# EAGLE design max_plate (EAGLE 7.5.0)
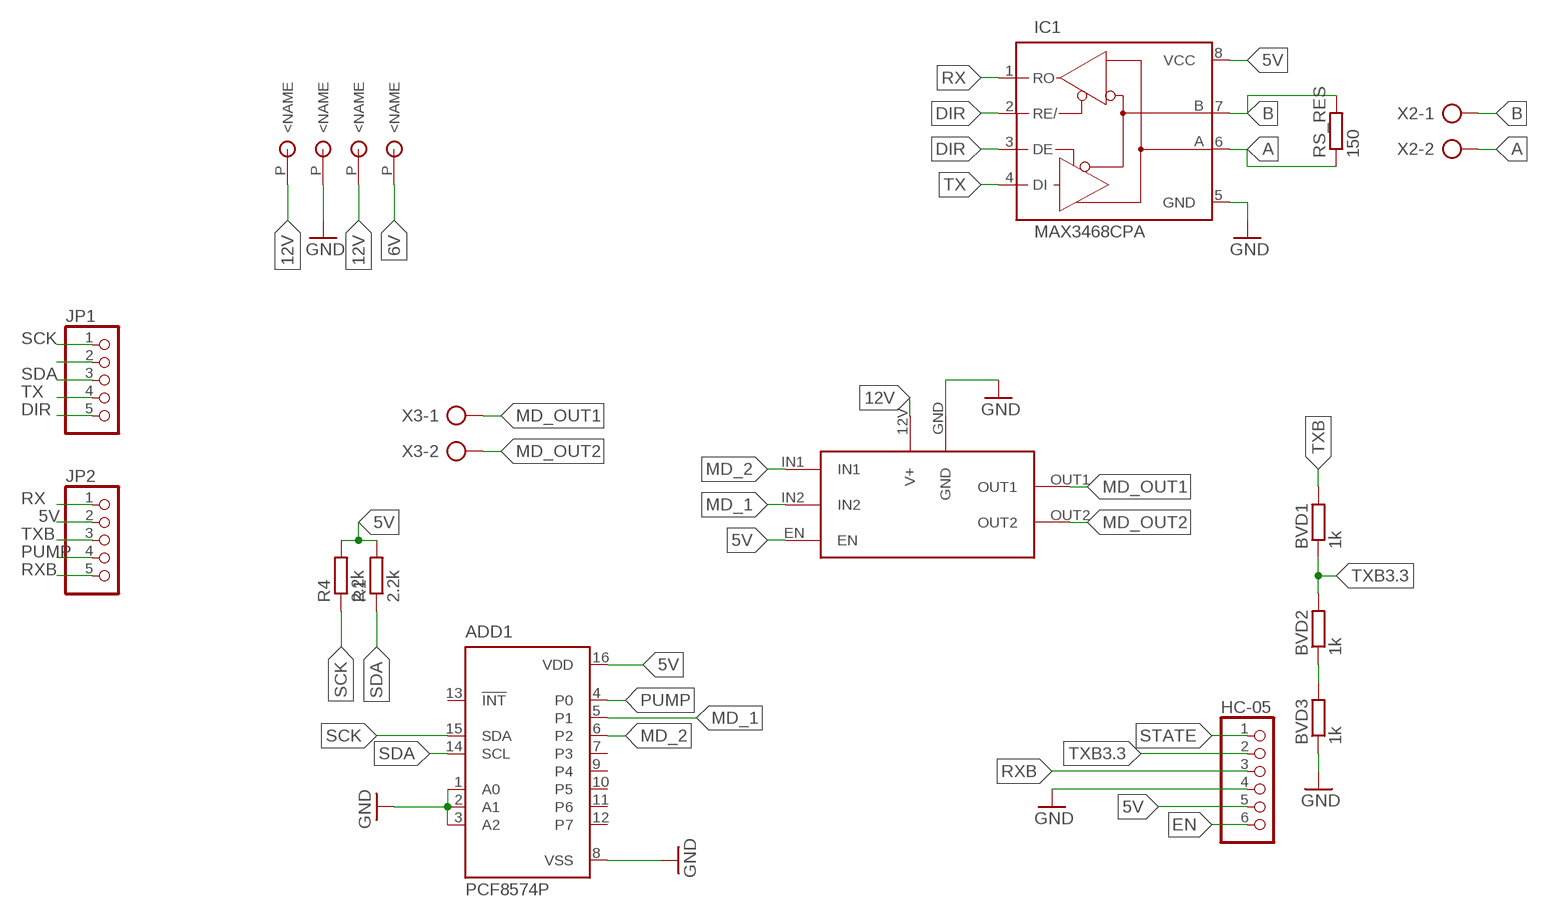
[diagram p0: schematic, sheet 1]

## Parts
ADD1  PCF8574P  [DIL16]
BVD1  1k  R-EU_0207/10  [0207/10]
BVD2  1k  R-EU_0207/10  [0207/10]
BVD3  1k  R-EU_0207/10  [0207/10]
HC-05  PINHD-1X6  [1X06]
IC1  MAX3468CPA  [DIL08]
JP1  PINHD-1X5  [1X05]
JP2  PINHD-1X5  [1X05]
R1  2.2k  R-EU_0207/10  [0207/10]
R4  2.2k  R-EU_0207/10  [0207/10]
RS_RES  150  R-EU_0207/10  [0207/10]
U$1  CU-SPACER  [CU-SPACER]
U$2  CU-SPACER  [CU-SPACER]
U$3  CU-SPACER  [CU-SPACER]
U$4  CU-SPACER  [CU-SPACER]
U$5  L6203-MODULE  [L6203-MODULE]
X2  AK500/2  [AK500/2]
X3  AK500/2  [AK500/2]

## Nets
5V: ADD1.16(VDD) HC-05.5 IC1.8(VCC) JP2.2 R1.2 R4.2 U$5.EN
6V: U$4.P(<NAME)
12V: U$1.P(<NAME) U$3.P(<NAME) U$5.12V(V+)
A: IC1.6(A) RS_RES.1 X2.2
B: IC1.7(B) RS_RES.2 X2.1
DIR: IC1.2(RE/) IC1.3(DE) JP1.5
EN: HC-05.6
GND: ADD1.1(A0) ADD1.2(A1) ADD1.3(A2) ADD1.8(VSS) BVD3.1 HC-05.4 IC1.5(GND) U$2.P(<NAME) U$5.GND
MD_1: ADD1.5(P1) U$5.IN2
MD_2: ADD1.6(P2) U$5.IN1
MD_OUT1: U$5.OUT1 X3.1
MD_OUT2: U$5.OUT2 X3.2
N$2: JP1.2
N$3: BVD2.1 BVD3.2
PUMP: ADD1.4(P0) JP2.4
RX: IC1.1(RO) JP2.1
RXB: HC-05.3 JP2.5
SCK: ADD1.15(SDA) JP1.1 R4.1
SDA: ADD1.14(SCL) JP1.3 R1.1
STATE: HC-05.1
TX: IC1.4(DI) JP1.4
TXB: BVD1.2 JP2.3
TXB3.3: BVD1.1 BVD2.2 HC-05.2
Unconnected: ADD1.7(P3) ADD1.9(P4) ADD1.10(P5) ADD1.11(P6) ADD1.12(P7) ADD1.13(!INT)

## Library data of the parts
ADD1 = micro-philips:PCF8574: I2C-Bus Remote 8-bit I/O expander http://www.semiconductors.philips.com/acrobat_download/datasheets/PCF8574_4.pdf; MPN: PCF8574PN; OC_FARNELL: 204020; OC_NEWARK: 11N8515
BVD1-BVD3 R1 R4 RS_RES = rcl:R-EU_: RESISTOR, European symbol
HC-05 = pinhead:PINHD-1X6: PIN HEADER
IC1 = maxim:MAX34*: +5V, Fail-Safe, 40Mbps, Profibus RS-485/RS-422 Transceivers Source: MAX3465-MAX3469.pdf; OC_FARNELL: unknown; OC_NEWARK: unknown
JP1 JP2 = pinhead:PINHD-1X5: PIN HEADER
U$1-U$4 = Aquaphoton:CU-SPACER
U$5 = Aquaphoton:L6203-MODULE
X2 X3 = con-ptr500:AK500/2: CONNECTOR; OC_FARNELL: unknown; OC_NEWARK: unknown

## Board
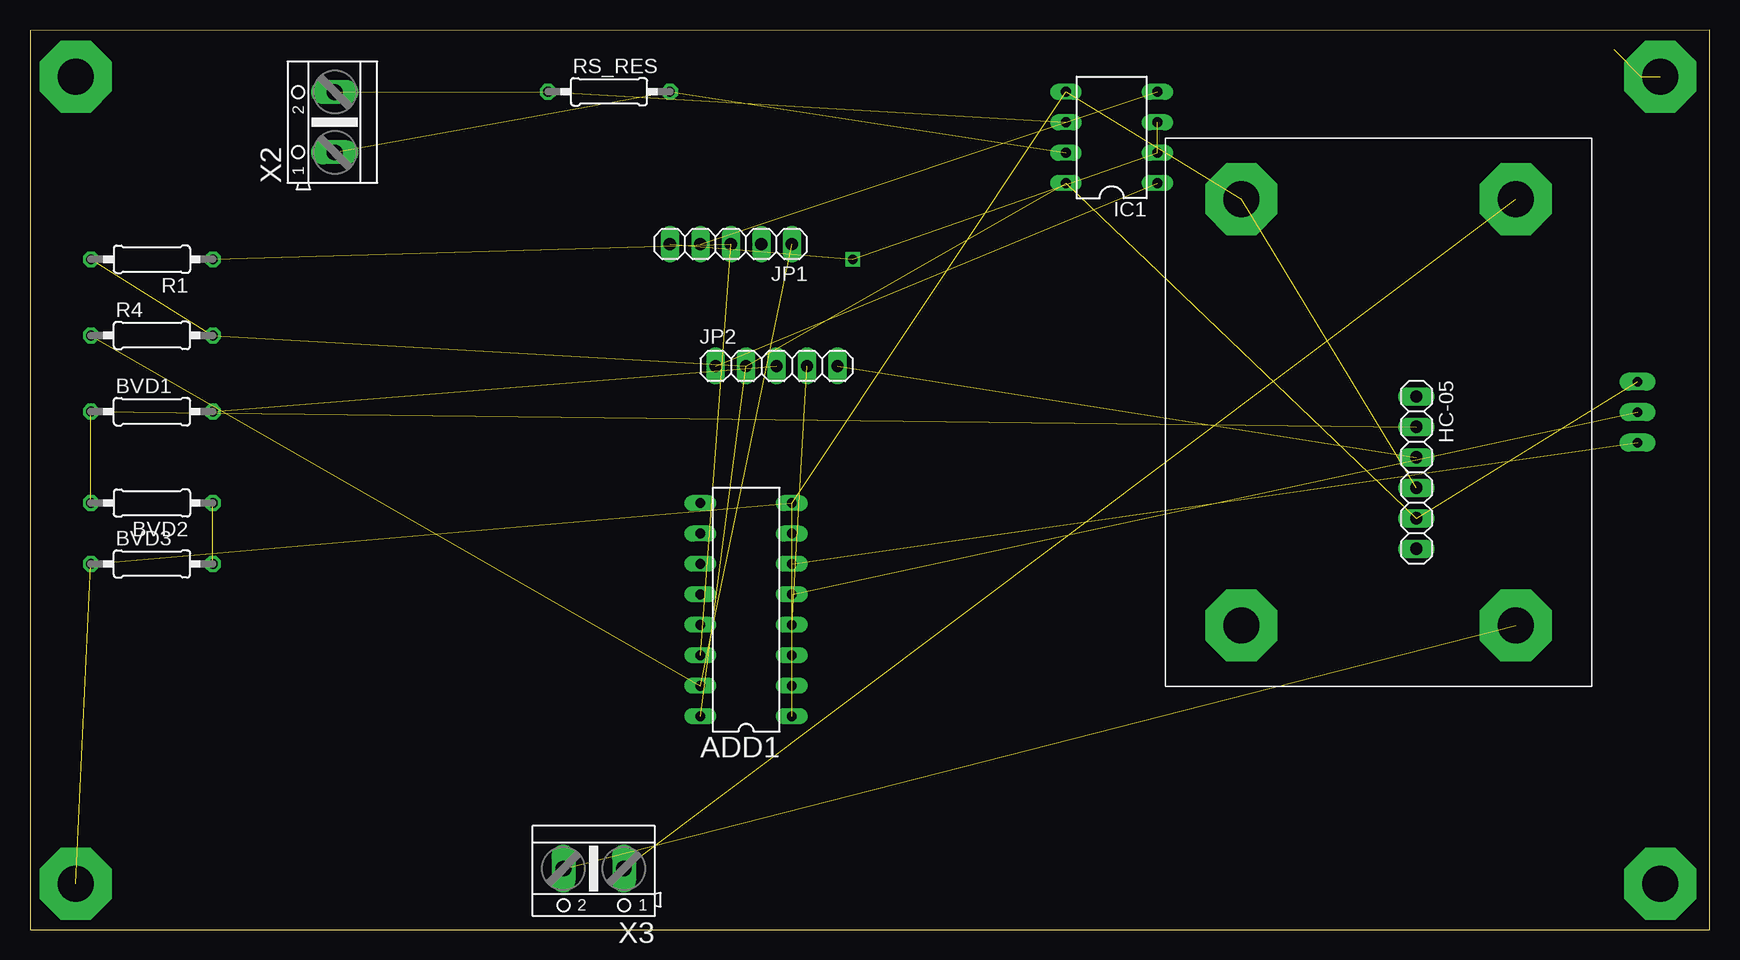
[diagram p1: board, top side]
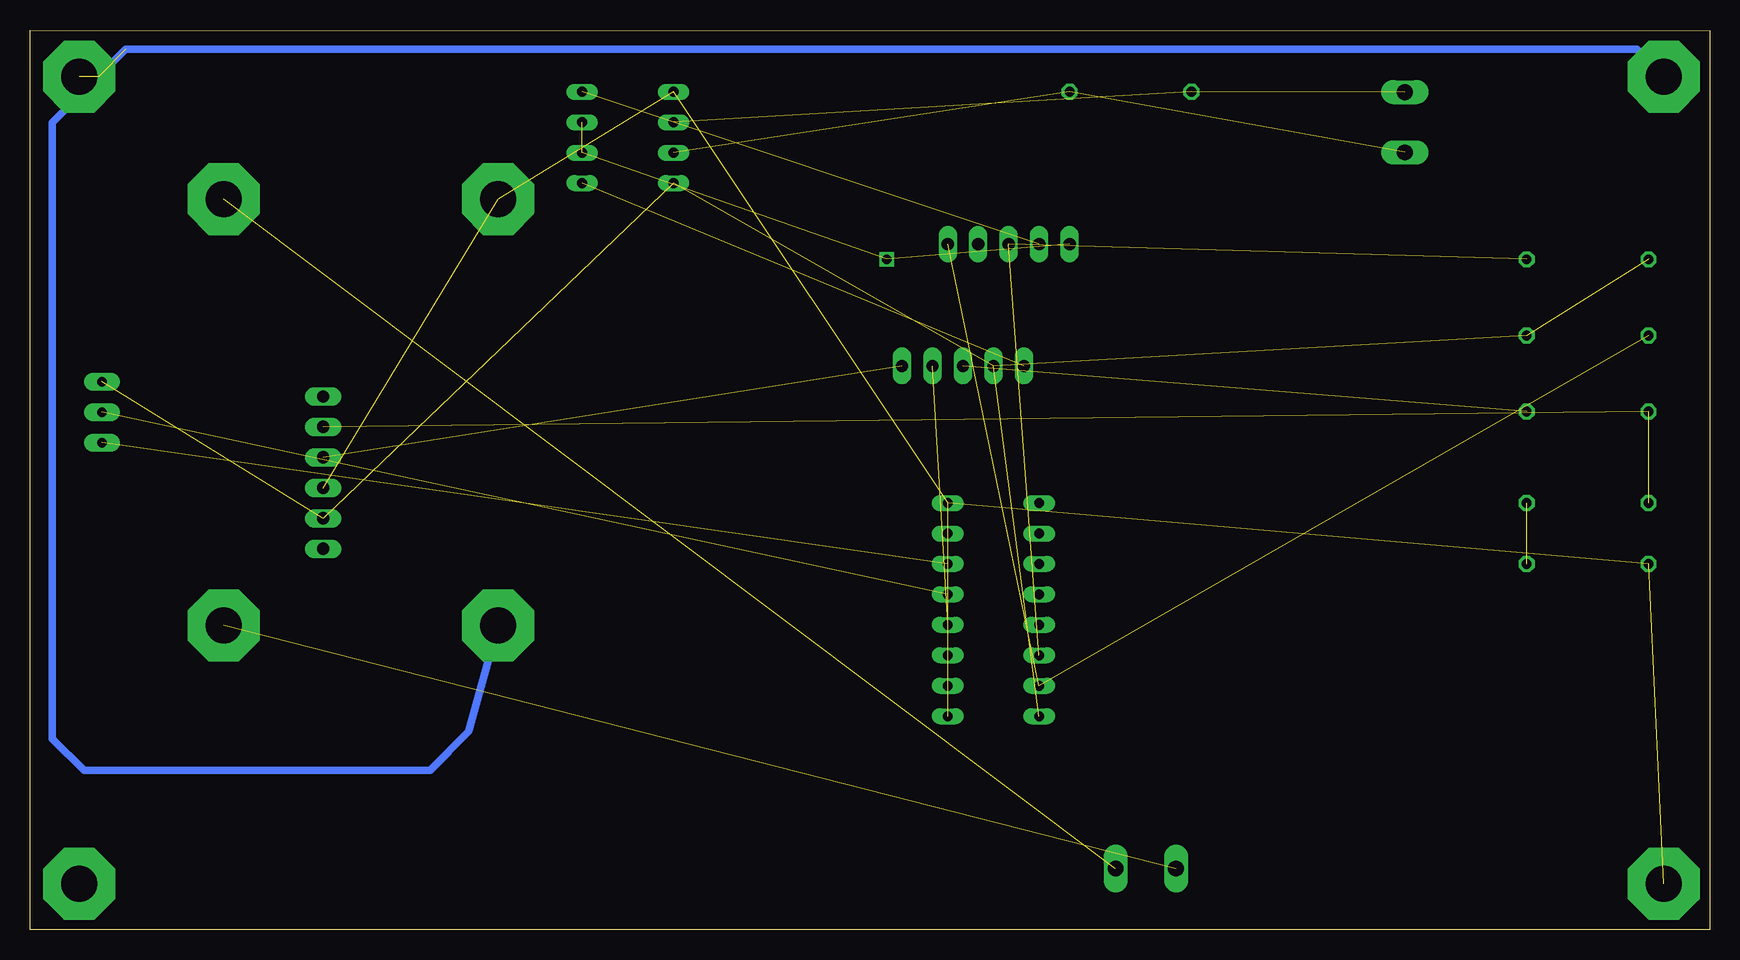
[diagram p2: board, bottom side, seen from below]

Size 140 x 75 mm. Coordinates in mm from the lower left corner, seen from the top.
Outline: 0,0 140,0 140,75 0,74.93 0,0
Copper layers (1*16): Top 0.035mm / dielectric 1.5mm / Bottom 0.035mm
Design rules "default *": minimum track width 0.8mm, minimum drill 0.8mm, track to track 0.8mm, track to pad 0.8mm, pad to pad 0.8mm, via to via 0.8mm, smd to smd 0.8mm, copper to edge 0.8mm, drill to drill 0.8mm, minimum pad ring 10mil, minimum via ring 8mil, stop-mask expansion 4mil, vias tented up to drill 0mil, thermal gap 10mil

### Footprints (pad centres in the part's own frame; a part is rotated, then mirrored left to right if it is on the bottom)
DIL16 = drill 0.813 long: 1 -8.89,-3.81; 2 -6.35,-3.81; 3 -3.81,-3.81; 4 -1.27,-3.81; 5 1.27,-3.81; 6 3.81,-3.81; 7 6.35,-3.81; 8 8.89,-3.81; 9 8.89,3.81; 10 6.35,3.81; 11 3.81,3.81; 12 1.27,3.81; 13 -1.27,3.81; 14 -3.81,3.81; 15 -6.35,3.81; 16 -8.89,3.81
0207/10 = drill 0.813 octagon: 1 -5.08,0; 2 5.08,0
1X06 = drill 1.016 long: 1 -6.35,0; 2 -3.81,0; 3 -1.27,0; 4 1.27,0; 5 3.81,0; 6 6.35,0
DIL08 = drill 0.813 long: 1 -3.81,-3.81; 2 -1.27,-3.81; 3 1.27,-3.81; 4 3.81,-3.81; 5 3.81,3.81; 6 1.27,3.81; 7 -1.27,3.81; 8 -3.81,3.81
1X05 = drill 1.016 long: 1 -5.08,0; 2 -2.54,0; 3 0,0; 4 2.54,0; 5 5.08,0
CU-SPACER = drill 3 pad 6 octagon: P 0,0
L6203-MODULE = drill 3 pad 6 octagon: 12V 5.08,29.21; GND 40.64,29.21; OUT1 40.64,6.35; OUT2 5.08,6.35 | drill 0.8 pad 1.5 long: EN 25.4,-3.81; IN1 20.32,-3.81; IN2 22.86,-3.81
AK500/2 = drill 1.321 long: 1 -2.515,0; 2 2.515,0

### Placement (x,y rotation side)
ADD1  59.69,26.67 90 top
BVD1  10.16,43.18 0 top
BVD2  10.16,35.56 180 top
BVD3  10.16,30.48 0 top
HC-05  115.57,38.1 270 top
IC1  90.17,66.04 90 top
JP1  58.42,57.15 180 top
JP2  62.23,46.99 0 top
R1  10.16,55.88 180 top
R4  10.16,49.53 0 top
RS_RES  48.26,69.85 0 top
U$1  135.89,71.12 0 top
U$2  3.81,3.81 0 top
U$3  3.81,71.12 0 top
U$4  135.89,3.81 0 top
U$5  130.19,20.28 90 top
X2  25.4,67.31 90 top
X3  46.99,5.08 180 top

### Tracks (layer width: path | path; a pad name or v marks a point on that pad's centre or on a via)
5V  (6 unrouted)
12V  (2 unrouted)
  Bottom 0.61: U$3.P 6.08,73.39 132.01,73.39 138.13,67.26 138.13,15.92 135.48,13.26 106.66,13.26 103.42,16.51 U$5.12V
A  (2 unrouted)
B  (2 unrouted)
DIR  (via drill 0.8)  (3 unrouted)
  other vias: 68.58,55.88
GND  (8 unrouted)
MD_1  (1 unrouted)
MD_2  (1 unrouted)
MD_OUT1  (1 unrouted)
MD_OUT2  (1 unrouted)
N$3  (1 unrouted)
PUMP  (1 unrouted)
RX  (1 unrouted)
RXB  (1 unrouted)
SCK  (2 unrouted)
SDA  (2 unrouted)
TX  (1 unrouted)
TXB  (1 unrouted)
TXB3.3  (2 unrouted)